# Altium schematic sheet 闹铃时钟电路.SchDoc
size A4
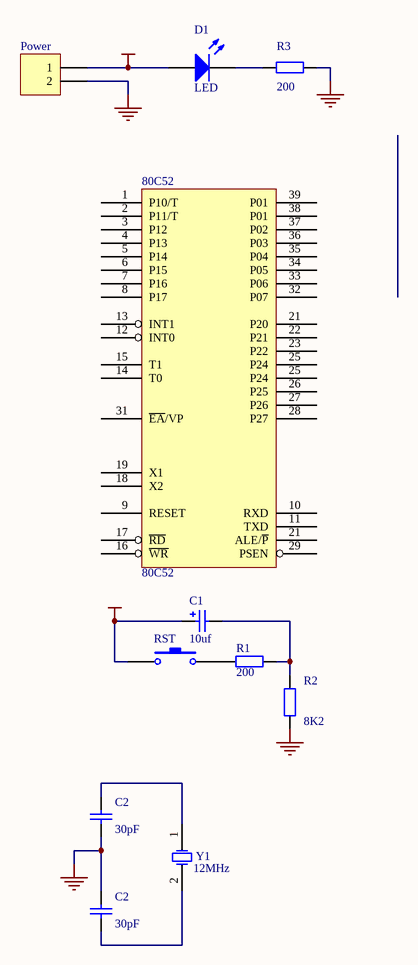
[diagram p0: 闹铃时钟电路.SchDoc]

## Parts
(Parts that share a designator on the sheet are numbered #1, #2 ... from top to bottom, then left to right.)
80C52  80C52
C1  10uf  [POLAR0.8]
C2#1  value 30pF  [RAD-0.3]  (hidden comment: Cap)
C2#2  value 30pF  [RAD-0.3]  (hidden comment: Cap)
D1  LED  [LED-0]
Power  Header 2  [HDR1X2]  (value not drawn)
R1  200  [AXIAL-0.4]
R2  value 8K2  [AXIAL-0.4]  (hidden comment: Res2)
R3  value 200  [AXIAL-0.4]  (hidden comment: Res2)
RST  SW-PB  [SPST-2]  (value not drawn)
Y1  12MHz  [BCY-W2/D3.1]

## Nets
GND: C2#1.1 C2#2.2 Power.2 R2.2 R3.2
VCC: C1.1 D1.1(A) Power.1 RST.1
NetC1_2: C1.2 R1.1 R2.1
NetC2#1_2: C2#1.2 Y1.1(OSC1)
NetC2#2_1: C2#2.1 Y1.2(OSC2)
NetD1_2: D1.2(K) R3.1
NetR1_2: R1.2 RST.2

Not connected (* = marked no-connect by the designer): 80C52 1(P10/T) 2(P11/T) 3(P12) 4(P13) 5(P14) 6(P15) 7(P16) 8(P17) 9(RESET) 10(RXD) 11(TXD) 12(INT0) 13(INT1) 14(T0) 15(T1) 16(~{WR}) 17(~{RD}) 18(X2) 19(X1) 21(ALE/~{P}) 22(P21) 23(P22) 25(P24) 26(P25) 27(P26) 28(P27) 29(PSEN) 31(~{EA}/VP) 32(P07) 33(P06) 34(P05) 35(P04) 36(P03) 37(P02) 38(P01) 39(P01)

## Library data of the parts
C1 = Cap Pol2: Polarized Capacitor (Axial); Published: 8-Jun-2000; LatestRevisionDate: 17-Jul-2002; LatestRevisionNote: Re-released for DXP Platform.; Publisher: Altium Limited
C2#1 C2#2 = Cap: Capacitor; Published: 8-Jun-2000; LatestRevisionDate: 17-Jul-2002; LatestRevisionNote: Re-released for DXP Platform.; Publisher: Altium Limited
D1 = LED0: Typical INFRARED GaAs LED; Published: 8-Jun-2000; LatestRevisionDate: 17-Jul-2002; LatestRevisionNote: Re-released for DXP Platform.; Publisher: Altium Limited
Power = Header 2: Header, 2-Pin; LatestRevisionDate: 17-Jul-2002; LatestRevisionNote: Re-released for DXP Platform.; Publisher: Altium Limited
R1-R3 = Res2: Resistor; Published: 8-Jun-2000; LatestRevisionDate: 17-Jul-2002; LatestRevisionNote: Re-released for DXP Platform.; Publisher: Altium Limited
RST = SW-PB: Switch; Published: 24-Mar-1999; LatestRevisionDate: 17-Jul-2002; LatestRevisionNote: Re-released for DXP Platform.; Publisher: Altium Limited
Y1 = XTAL: Crystal Oscillator; Published: 8-Jun-2000; LatestRevisionDate: 17-Jul-2002; LatestRevisionNote: Re-released for DXP Platform.; Publisher: Altium Limited